# EAGLE design rfm69pi2_rj11_ct (EAGLE 9.6.2)
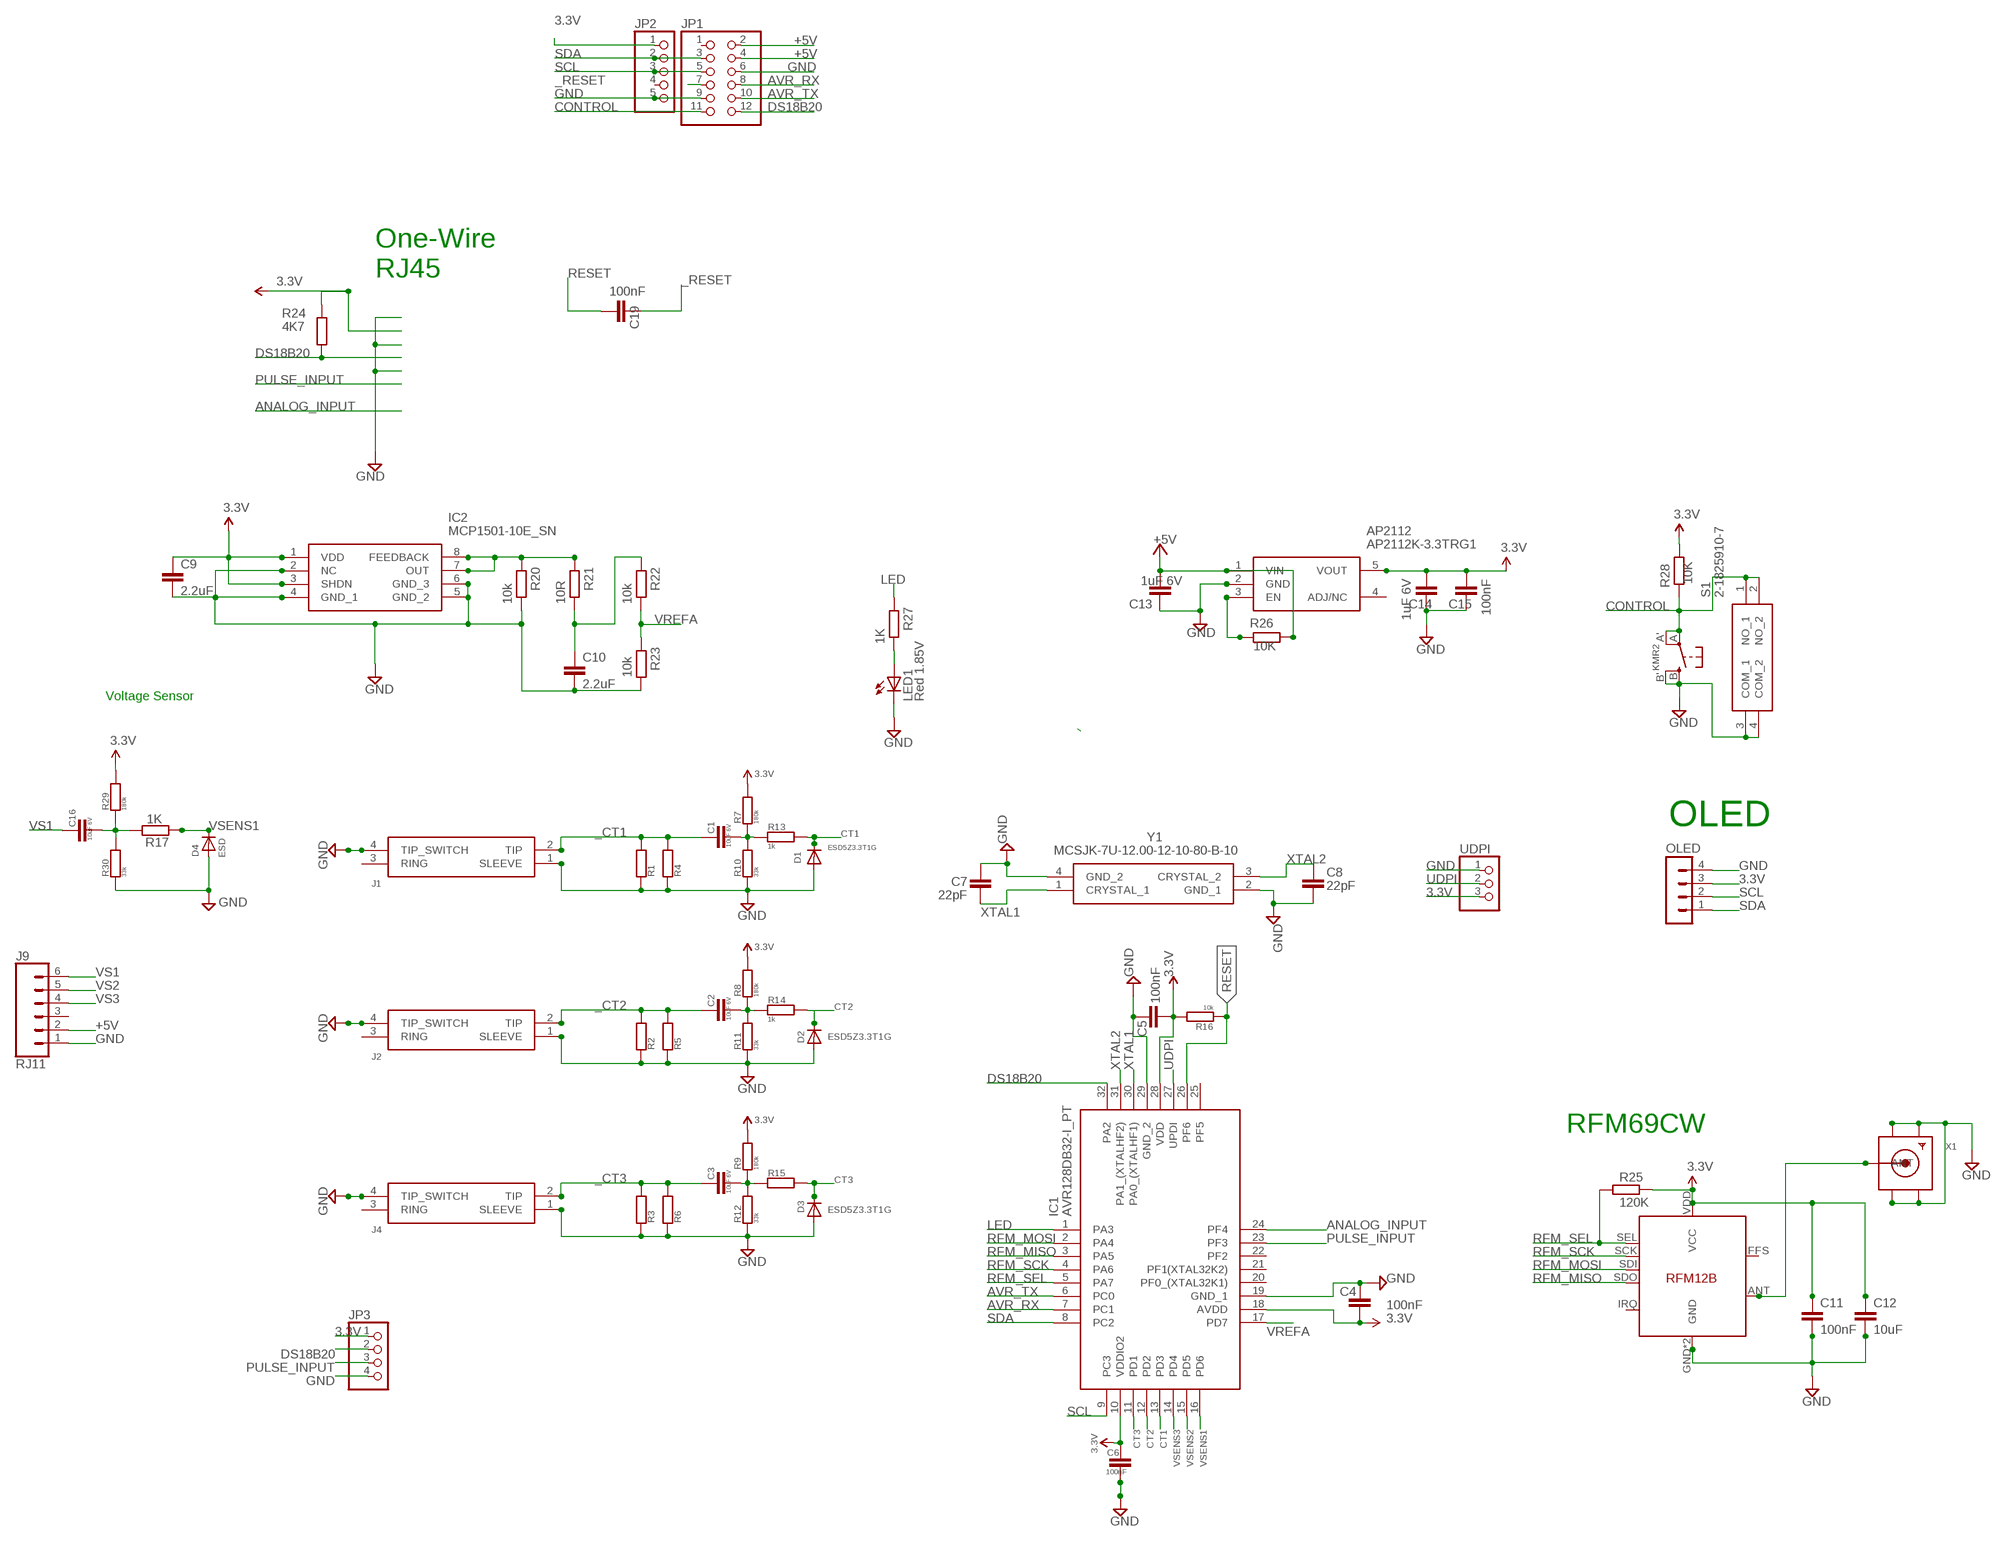
[diagram p0: schematic, sheet 1]

## Parts
AP2112  AP2112K-3.3TRG1  [SOT95P282X130-5N]
C1  10uF 6V  C-EUC0603  [C0603]
C2  10uF 6V  C-EUC0603  [C0603]
C3  10uF 6V  C-EUC0603  [C0603]
C4  100nF  C-EUC0603  [C0603]
C5  100nF  C-EUC0603  [C0603]
C6  100nF  C-EUC0603  [C0603]
C7  22pF  C-EUC0603  [C0603]
C8  22pF  C-EUC0603  [C0603]
C9  2.2uF  C-EUC0603  [C0603]
C10  2.2uF  C-EUC0603  [C0603]
C11  100nF  C-EUC0603  [C0603]
C12  10uF  C-EUC0603  [C0603]
C13  1uF 6V  C-EUC0603  [C0603]
C14  1uF 6V  C-EUC0603  [C0603]
C15  100nF  C-EUC0603  [C0603]
C16  10uF 6V  C-EUC0603  [C0603]
C19  100nF  C-EUC0603  [C0603]
CTRL  KMR2  SWITCH_TACT_SMT4.6X2.8  [BTN_KMR2_4.6X2.8]
D1  ESD5Z3.3T1G  DIODESOD-523  [SOD-523]
D2  ESD5Z3.3T1G  DIODESOD-523  [SOD-523]
D3  ESD5Z3.3T1G  DIODESOD-523  [SOD-523]
D4  ESD  DIODESOD-523  [SOD-523]
IC1  AVR128DB32-I_PT  [QFP80P900X900X120-32N]
IC2  MCP1501-10E_SN  [SOIC127P600X175-8N]
J1  SJ-3524-SMT-TR  [SJ-3524-SMT-TR]
J2  SJ-3524-SMT-TR  [SJ-3524-SMT-TR]
J4  SJ-3524-SMT-TR  [SJ-3524-SMT-TR]
J9  RJ11  RJ11-6  [RJ11-6]
JP1  PINHD-2X6  [2X06]
JP2  PINHD-1X5  [1X05]
JP3  PINHD-1X4  [1X04]
LED1  Red 1.85V  LEDCHIP-LED0805  [CHIP-LED0805]
OLED  MA04-1-OLEDOLED  [MA04-1-OLED]
R1  R-EU_R1206  [R1206]
R2  R-EU_R1206  [R1206]
R3  R-EU_R1206  [R1206]
R4  R-EU_0204/7  [0204/7]
R5  R-EU_0204/7  [0204/7]
R6  R-EU_0204/7  [0204/7]
R7  180k  R-EU_R0603  [R0603]
R8  180k  R-EU_R0603  [R0603]
R9  180k  R-EU_R0603  [R0603]
R10  33k  R-EU_R0603  [R0603]
R11  33k  R-EU_R0603  [R0603]
R12  33k  R-EU_R0603  [R0603]
R13  1k  R-EU_R0603  [R0603]
R14  1k  R-EU_R0603  [R0603]
R15  1k  R-EU_R0603  [R0603]
R16  10k  R-EU_R0603  [R0603]
R17  1K  R-EU_R0603  [R0603]
R20  10k  R-EU_R0603  [R0603]
R21  10R  R-EU_R0603  [R0603]
R22  10k  R-EU_R0603  [R0603]
R23  10k  R-EU_R0603  [R0603]
R24  4K7  R-EU_R0603  [R0603]
R25  120K  R-EU_R0603  [R0603]
R26  10K  R-EU_R0603  [R0603]
R27  1K  R-EU_R0603  [R0603]
R28  10K  R-EU_R0603  [R0603]
R29  180k  R-EU_R0603  [R0603]
R30  33k  R-EU_R0603  [R0603]
S1  2-1825910-7  [218259107]
U$14  RFM12B  [RFM12B]
UDPI  PINHD-1X3  [1X03]
X1  SMACONNECTOR  [SMA90_DIP]
Y1  MCSJK-7U-12.00-12-10-80-B-10  [MCSJK7U1200121080B10]

## Nets
3.3V: AP2112.5(VOUT) C4.1 C5.2 C6.1 C9.1 C11.1 C12.1 C14.2 C15.2 IC1.10(VDDIO2) IC1.18(AVDD) IC1.28(VDD) IC2.1(VDD) IC2.3(SHDN) JP2.1 JP3.1 OLED.3 R7.2 R8.2 R9.2 R16.2 R24.1 R25.2 R28.1 R29.2 U$14.VDD(VCC) UDPI.3
+5V [power]: AP2112.1(VIN) C13.2 J9.2 JP1.2 JP1.4 R26.1
_CT1: C1.1 J1.2(TIP) R1.2 R4.2
_CT2: C2.1 J2.2(TIP) R2.2 R5.2
_CT3: C3.1 J4.2(TIP) R3.2 R6.2
_RESET: C19.1 JP1.7
ANALOG_INPUT: IC1.24(PF4)
AVR_RX: IC1.7(PC1) JP1.8
AVR_TX: IC1.6(PC0) JP1.10
CONTROL: CTRL.A'(P1) CTRL.A(P) JP1.11 R28.2 S1.1(NO_1) S1.2(NO_2)
CT1: D1.K(C) IC1.13(PD3) R13.2
CT2: D2.K(C) IC1.12(PD2) R14.2
CT3: D3.K(C) IC1.11(PD1) R15.1
DIG1: U$14.ANT X1.ANTENNA(ANT)
DS18B20: IC1.32(PA2) JP1.12 JP3.2 R24.2
GND [gnd]: AP2112.2(GND) C4.2 C5.1 C6.2 C7.1 C8.2 C9.2 C10.2 C11.2 C12.2 C13.1 C14.1 C15.1 CTRL.B'(S1) CTRL.B(S) D1.A D2.A D3.A D4.A IC1.19(GND_1) IC1.29(GND_2) IC2.2(NC) IC2.4(GND_1) IC2.5(GND_2) IC2.6(GND_3) J1.1(SLEEVE) J1.4(TIP_SWITCH) J2.1(SLEEVE) J2.4(TIP_SWITCH) J4.1(SLEEVE) J4.4(TIP_SWITCH) J9.1 JP1.6 JP1.9 JP2.5 JP3.4 LED1.C OLED.4 R1.1 R2.1 R3.1 R4.1 R5.1 R6.1 R10.2 R11.2 R12.2 R20.1 R23.1 R30.2 S1.3(COM_1) S1.4(COM_2) U$14.GND U$14.P$12(GND) UDPI.1 X1.GND1 X1.GND2 X1.GND3 X1.GND4 Y1.2(GND_1) Y1.4(GND_2)
LED: IC1.1(PA3) R27.2
N$2: C16.2 R17.2 R29.1 R30.1
N$14: C10.1 R21.1 R22.2
N$15: AP2112.3(EN) R26.2
N$16: C2.2 R8.1 R11.1 R14.1
N$18: C1.2 R7.1 R10.1 R13.1
N$21: C3.2 R9.1 R12.1 R15.2
N$27: IC2.7(OUT) IC2.8(FEEDBACK) R20.2 R21.2
N$41: LED1.A R27.1
PULSE_INPUT: IC1.23(PF3) JP3.3
RESET: C19.2 IC1.26(PF6) R16.1
RFM_MISO: IC1.3(PA5) U$14.SDO
RFM_MOSI: IC1.2(PA4) U$14.SDI
RFM_SCK: IC1.4(PA6) U$14.SCK
RFM_SEL: IC1.5(PA7) R25.1 U$14.SEL
SCL: IC1.9(PC3) JP1.5 JP2.3 OLED.2
SDA: IC1.8(PC2) JP1.3 JP2.2 OLED.1
UDPI: IC1.27(UPDI) UDPI.2
VREFA: IC1.17(PD7) R22.1 R23.2
VS1: C16.1 J9.6
VS2: J9.5
VS3: J9.4
VSENS1: D4.K(C) IC1.16(PD6) R17.1
VSENS2: IC1.15(PD5)
VSENS3: IC1.14(PD4)
XTAL1: C7.2 IC1.30(PA0_(XTALHF1)) Y1.1(CRYSTAL_1)
XTAL2: C8.1 IC1.31(PA1_(XTALHF2)) Y1.3(CRYSTAL_2)
Unconnected: AP2112.4(ADJ/NC) IC1.20(PF0_(XTAL32K1)) IC1.21(PF1(XTAL32K2)) IC1.22(PF2) IC1.25(PF5) J1.3(RING) J2.3(RING) J4.3(RING) J9.3 JP1.1 JP2.4 U$14.FFS U$14.IRQ

## Notes on the sheet
- One-Wire
  RJ45
- Voltage Sensor
- OLED
- RFM69CW

## Library data of the parts
AP2112 = AP2112K-3.3TRG1:AP2112K-3.3TRG1: 600mA 3.3V LDO Regulator Enable SOT23-5 DiodesZetex AP2112K-3.3TRG1, LDO Voltage Regulator, 3.3 V +/-1.5%, 2.5 6 Vin, 5-Pin SOT-23 Source: Datasheet <http://uk.rs-online.com/web/p/products/8283509>; ARROW_PART_NUMBER: AP2112K-3.3TRG1; ARROW_PRICE-STOCK: https://www.arrow.com/en/products/ap2112k-3.3trg1/diodes-incorporated?region=nac; DESCRIPTION: 600mA 3.3V LDO Regulator Enable SOT23-5 DiodesZetex AP2112K-3.3TRG1, LDO Voltage Regulator, 3.3 V +/-1.5%, 2.5 6 Vin, 5-Pin SOT-23; HEIGHT: 1.3mm; MANUFACTURER_NAME: Diodes Inc.; MANUFACTURER_PART_NUMBER: AP2112K-3.3TRG1; MOUSER_PART_NUMBER: 621-AP2112K-3.3TRG1; MOUSER_PRICE-STOCK: https://www.mouser.co.uk/ProductDetail/Diodes-Incorporated/AP2112K-33TRG1?qs=x6A8l6qLYDDPYHosCdzh%2FA%3D%3D
C1-C3 C6-C8 C13-C16 C19 = resistor:C-EU: CAPACITOR, European symbol
C4 C5 C9-C12 = rcl:C-EU: CAPACITOR, European symbol
CTRL = microbuilder:SWITCH_TACT_SMT: SMT Tact Switches 6x6mm - Digikey: P12940SCT-ND KMR2 (4.6x2.8mm) - Digikey: 401-1426-1-ND EVQ-PQHB55 - Light Touch, 160GF (4.5x4.5mm) - Digikey: P8090SCT-ND KMT0 - KMT021 NGJ LHS (etc.) IP68/Waterproof - Digikey: CKN10289CT-ND
D1-D4 = microbuilder:DIODE: Diode SMA Model Volts Amps Type Vf Vr Digikey # Notes SSA34-E3 40V 3A Schottky 480mV @ 3A 200uA @ 40V SSA34-E3/61TGITR-ND CDBA120-G 20V 1A Schottky 500mV @ 1A 500uA @ 20V 641-1014-6-ND REEL MBRA210 10V 2A Schottky 350mV @ 2A 700uA @ 10V MBRA210LT3 SOD-123 Model Volts Amps Type Vf Vr Order # Notes BAT54T1G 30V 200mA Schottky 800mV @ 200mA 2uA @ 25V BAT54T1GOSTR-ND B0530W 30V 500mA Schottky 430mV @ 500mA 130uA @ 30V B0530W-FDICT-ND REEL MBR120 1A 20V Schottky 340mV @ 1A MBR120VLSFT1GOSCT-ND SOD-323 Model Volts Amps Type Vf Vr Order # Notes PMEG2005EJ 20V 500mA Schottky 355mV @ 500mA 568-4110-1-ND ZLLS410 10V 570mA Schottky 380mV @ 570mA ZLLS410CT-ND 1N4148WS 75V 150mA Silicon/Simple 1V 1N4148WSFSCT-ND REEL SOD-523 Model Volts Amps Type Vf Vr Order # Notes BAT54XV2 30V 200mA Schottky 0.8V @ 100mA BAT54XV2CT-ND TB751S 30V 30mA Schottky RB751S-40TE61CT-ND SOT23-R/W (R = Solder Paste/Reflow Ovens, W = Hand-Soldering) Model Volts Amps Type Vf Vr Order # Notes BAT54FILM 40V 300mA Schottky 497-7162-1-ND
IC1 = AVR128DB32-I_PT:AVR128DB32-I_PT: 128KB, TQFP32, 85C, 24MHZ, 12B ADC, COMP, OPAMP, MVIO, ZCD, DAC, UART, SPI, TWI, 32 TQFP 7X7X1MM TRAY ROHS COMPLIANT: YES Source: Datasheet <http://ww1.microchip.com/downloads/en/DeviceDoc/AVR128DB28-32-48-64-DataSheet-DS40002247A.pdf>; ARROW_PART_NUMBER: AVR128DB32-I/PT; ARROW_PRICE-STOCK: https://www.arrow.com/en/products/avr128db32-ipt/microchip-technology?region=nac; DESCRIPTION: 128KB, TQFP32, 85C, 24MHZ, 12B ADC, COMP, OPAMP, MVIO, ZCD, DAC, UART, SPI, TWI, 32 TQFP 7X7X1MM TRAY ROHS COMPLIANT: YES; HEIGHT: 1.2mm; MANUFACTURER_NAME: Microchip; MANUFACTURER_PART_NUMBER: AVR128DB32-I/PT; MOUSER_PART_NUMBER: 579-AVR128DB32-I/PT; MOUSER_PRICE-STOCK: https://www.mouser.co.uk/ProductDetail/Microchip-Technology/AVR128DB32-I-PT?qs=vmHwEFxEFR%252BrKeBb9KOKBg%3D%3D
IC2 = MCP1501-10E_SN:MCP1501-10E_SN: MICROCHIP - MCP1501-10E/SN - VOLTAGE REF, SERIES, 1.024V, NSOIC-8 Source: Datasheet <http://www.farnell.com/datasheets/2015662.pdf>; ARROW_PART_NUMBER: MCP1501-10E/SN; ARROW_PRICE-STOCK: https://www.arrow.com/en/products/mcp1501-10esn/microchip-technology; DESCRIPTION: MICROCHIP - MCP1501-10E/SN - VOLTAGE REF, SERIES, 1.024V, NSOIC-8; HEIGHT: 1.75mm; MANUFACTURER_NAME: Microchip; MANUFACTURER_PART_NUMBER: MCP1501-10E/SN; MOUSER_PART_NUMBER: 579-MCP1501-10E/SN; MOUSER_PRICE-STOCK: https://www.mouser.co.uk/ProductDetail/Microchip-Technology/MCP1501-10E-SN?qs=BA62vJVifGrukY%252BvRXgfwQ%3D%3D
J1 J2 J4 = SJ-3524-SMT-TR:SJ-3524-SMT-TR: Phone Connectors Audio Jacks Source: Datasheet <https://datasheet.datasheetarchive.com/originals/distributors/Datasheets-DGA1/151896.pdf>; ARROW_PART_NUMBER: SJ-3524-SMT-TR; ARROW_PRICE-STOCK: https://www.arrow.com/en/products/sj-3524-smt-tr/cui-devices?region=nac; DESCRIPTION: Phone Connectors Audio Jacks; HEIGHT: mm; MANUFACTURER_NAME: CUI Inc.; MANUFACTURER_PART_NUMBER: SJ-3524-SMT-TR; MOUSER_PART_NUMBER: 490-SJ-3524-SMT-TR; MOUSER_PRICE-STOCK: https://www.mouser.co.uk/ProductDetail/CUI-Devices/SJ-3524-SMT-TR?qs=WyjlAZoYn50%252B7OcNbxvx%252BA%3D%3D
J9 = SparkFun-Connectors:RJ11-6: RJ11 Jack - 6 pin Commonly found on CAT3 devices and some Microchip programmers. Here is the connector we sell at SparkFun: RJ11 6-Pin Connector <https://www.sparkfun.com/products/132> (PRT-00132) Datasheet <http://www.sparkfun.com/datasheets/Prototyping/Connectors/RJ11-Datasheet.pdf> It is used on this SparkFun product: SparkFun Weather Shield <https://www.sparkfun.com/products/12081> (DEV-12081) Weather Meters <https://www.sparkfun.com/products/8942> (SEN-08942); PROD_ID: CONN-08590; SF_ID: PRT-00132
JP1 = pinhead:PINHD-2X6: PIN HEADER
JP2 = pinhead:PINHD-1X5: PIN HEADER
JP3 = pinhead:PINHD-1X4: PIN HEADER
LED1 = adafruit:LED: LED OSRAM: - CHIPLED LG R971, LG N971, LY N971, LG Q971, LY Q971, LO R971, LY R971 LH N974, LH R974 LS Q976, LO Q976, LY Q976 LO Q996 - Hyper CHIPLED LW Q18S LB Q993, LB Q99A, LB R99A - SideLED LS A670, LO A670, LY A670, LG A670, LP A670 LB A673, LV A673, LT A673, LW A673 LH A674 LY A675 LS A676, LA A676, LO A676, LY A676, LW A676 LS A679, LY A679, LG A679 - Hyper Micro SIDELED® LS Y876, LA Y876, LO Y876, LY Y876 LT Y87S - SmartLED LW L88C, LW L88S LB L89C, LB L89S, LG L890 LS L89K, LO L89K, LY L89K LS L896, LA L896, LO L896, LY L896 - TOPLED LS T670, LO T670, LY T670, LG T670, LP T670 LSG T670, LSP T670, LSY T670, LOP T670, LYG T670 LG T671, LOG T671, LSG T671 LB T673, LV T673, LT T673, LW T673 LH T674 LS T676, LA T676, LO T676, LY T676, LB T676, LH T676, LSB T676, LW T676 LB T67C, LV T67C, LT T67C, LS T67K, LO T67K, LY T67K, LW E67C LS E67B, LA E67B, LO E67B, LY E67B, LB E67C, LV E67C, LT E67C LW T67C LS T679, LY T679, LG T679 LS T770, LO T770, LY T770, LG T770, LP T770 LB T773, LV T773, LT T773, LW T773 LH T774 LS E675, LA E675, LY E675, LS T675 LS T776, LA T776, LO T776, LY T776, LB T776 LHGB T686 LT T68C, LB T68C - Hyper Mini TOPLED® LB M676 - Mini TOPLED Santana® LG M470 LS M47K, LO M47K, LY M47K Source: http://www.osram.convergy.de/
OLED = con-lstb-db:MA04-1-OLED: PIN HEADER with OLED footprint.
R1-R17 R20-R30 = rcl:R-EU_: RESISTOR, European symbol
S1 = 2-1825910-7:2-1825910-7: Relays, Contactors & Switches Switches Tactile Switches FSM14JH=6MM TACT SWITCH, HIGH TEMP Source: Datasheet <http://www.te.com/commerce/DocumentDelivery/DDEController?Action=showdoc&DocId=Customer Drawing1825910C10pdfEnglishENG_CD_1825910_C10.pdf2-1825910-7>; ARROW_PART_NUMBER: 2-1825910-7; ARROW_PRICE-STOCK: https://www.arrow.com/en/products/2-1825910-7/te-connectivity?region=europe; DESCRIPTION: Relays, Contactors & Switches Switches Tactile Switches FSM14JH=6MM TACT SWITCH, HIGH TEMP; HEIGHT: 13mm; MANUFACTURER_NAME: TE Connectivity; MANUFACTURER_PART_NUMBER: 2-1825910-7; MOUSER_PART_NUMBER: 506-2-1825910-7; MOUSER_PRICE-STOCK: https://www.mouser.co.uk/ProductDetail/TE-Connectivity-PB/2-1825910-7?qs=epcAG6di8szpGFLvuwXKeQ%3D%3D
U$14 = JeeParts:RFM12B
UDPI = adafruit:PINHD-1X3: PIN HEADER
X1 = adafruit:SMACONNECTOR: SMA Connector 90° DIP SMA Connector, 50 Ohm (4UConnector: 07259)
Y1 = MCSJK-7U-12.00-12-10-80-B-10:MCSJK-7U-12.00-12-10-80-B-10: CRYSTAL, 12MHZ, 12PF, 3.2MM X 2.5MM Source: Datasheet <https://componentsearchengine.com/Datasheets/2/MCSJK-7U-12.00-12-10-80-B-10.pdf>; DESCRIPTION: CRYSTAL, 12MHZ, 12PF, 3.2MM X 2.5MM; HEIGHT: 0.8mm; MANUFACTURER_NAME: MULTICOMP; MANUFACTURER_PART_NUMBER: MCSJK-7U-12.00-12-10-80-B-10

## Net classes
0 default: width 0.203 mm, drill 0.6 mm, clearance 0.203 mm
1 power: width 0.305 mm, drill 0.6 mm, clearance 0.254 mm
2 gnd: width 0.254 mm, drill 0.6 mm, clearance 0.254 mm
3 5V0_PI: width 0.406 mm, drill 0.4 mm
4 3V3_PI: width 0.254 mm, drill 0.4 mm

## Board
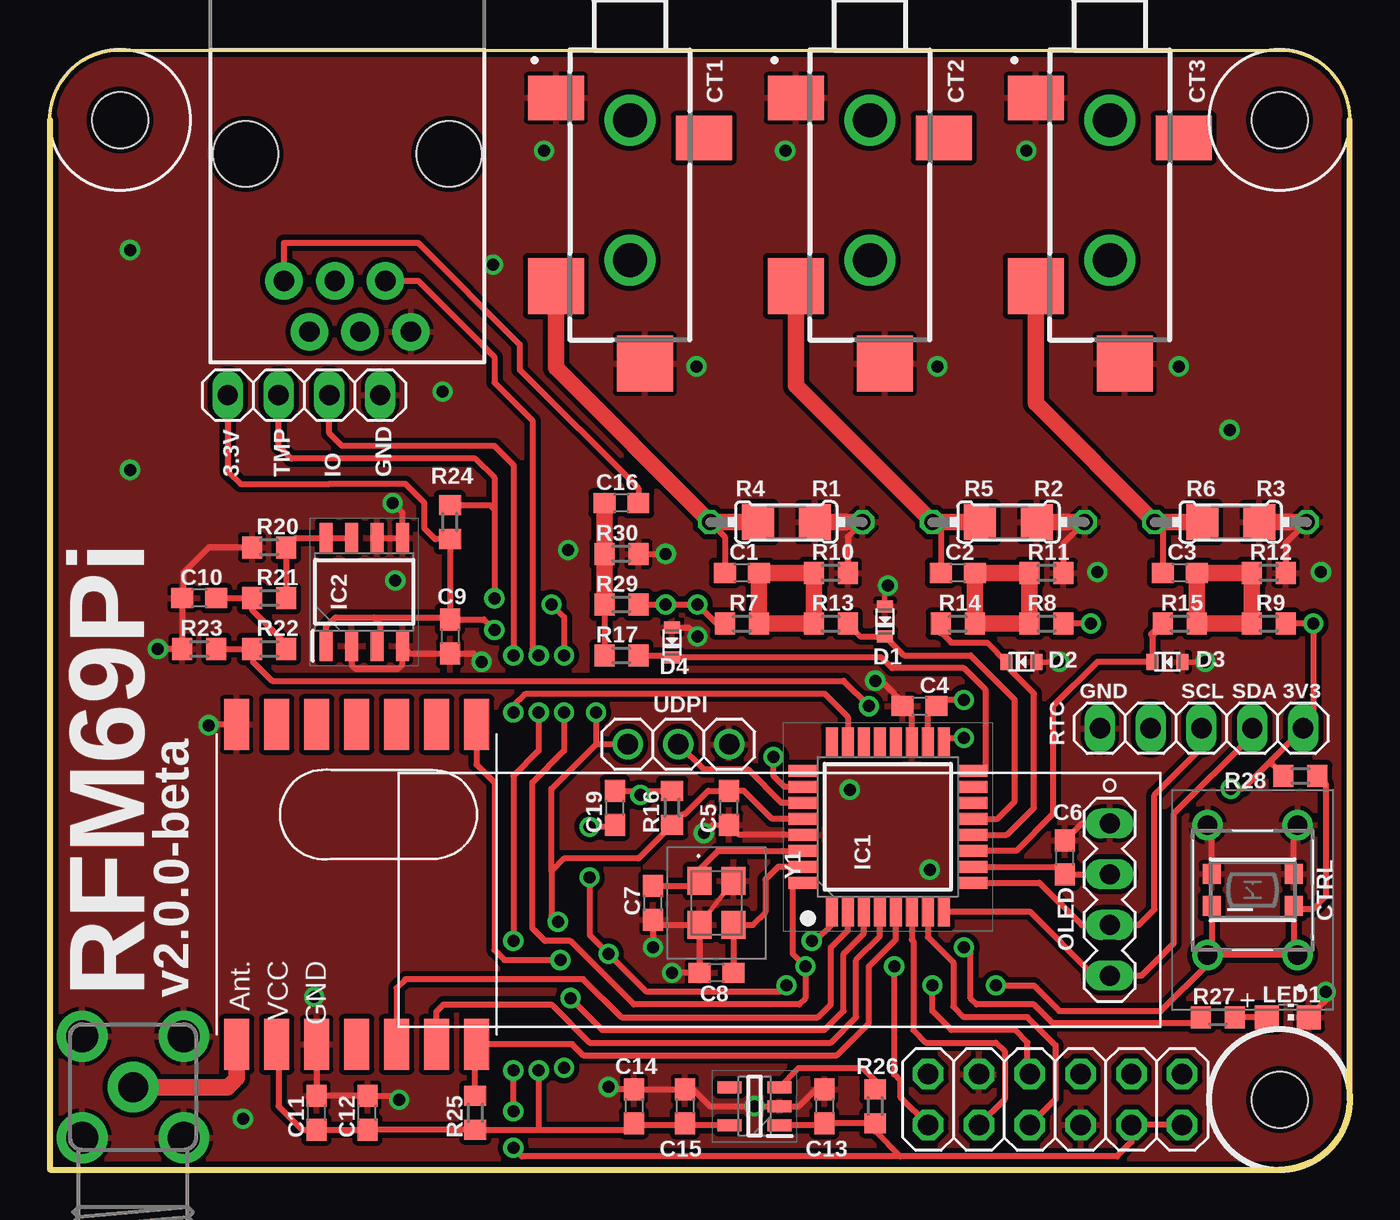
[diagram p1: board, top side]
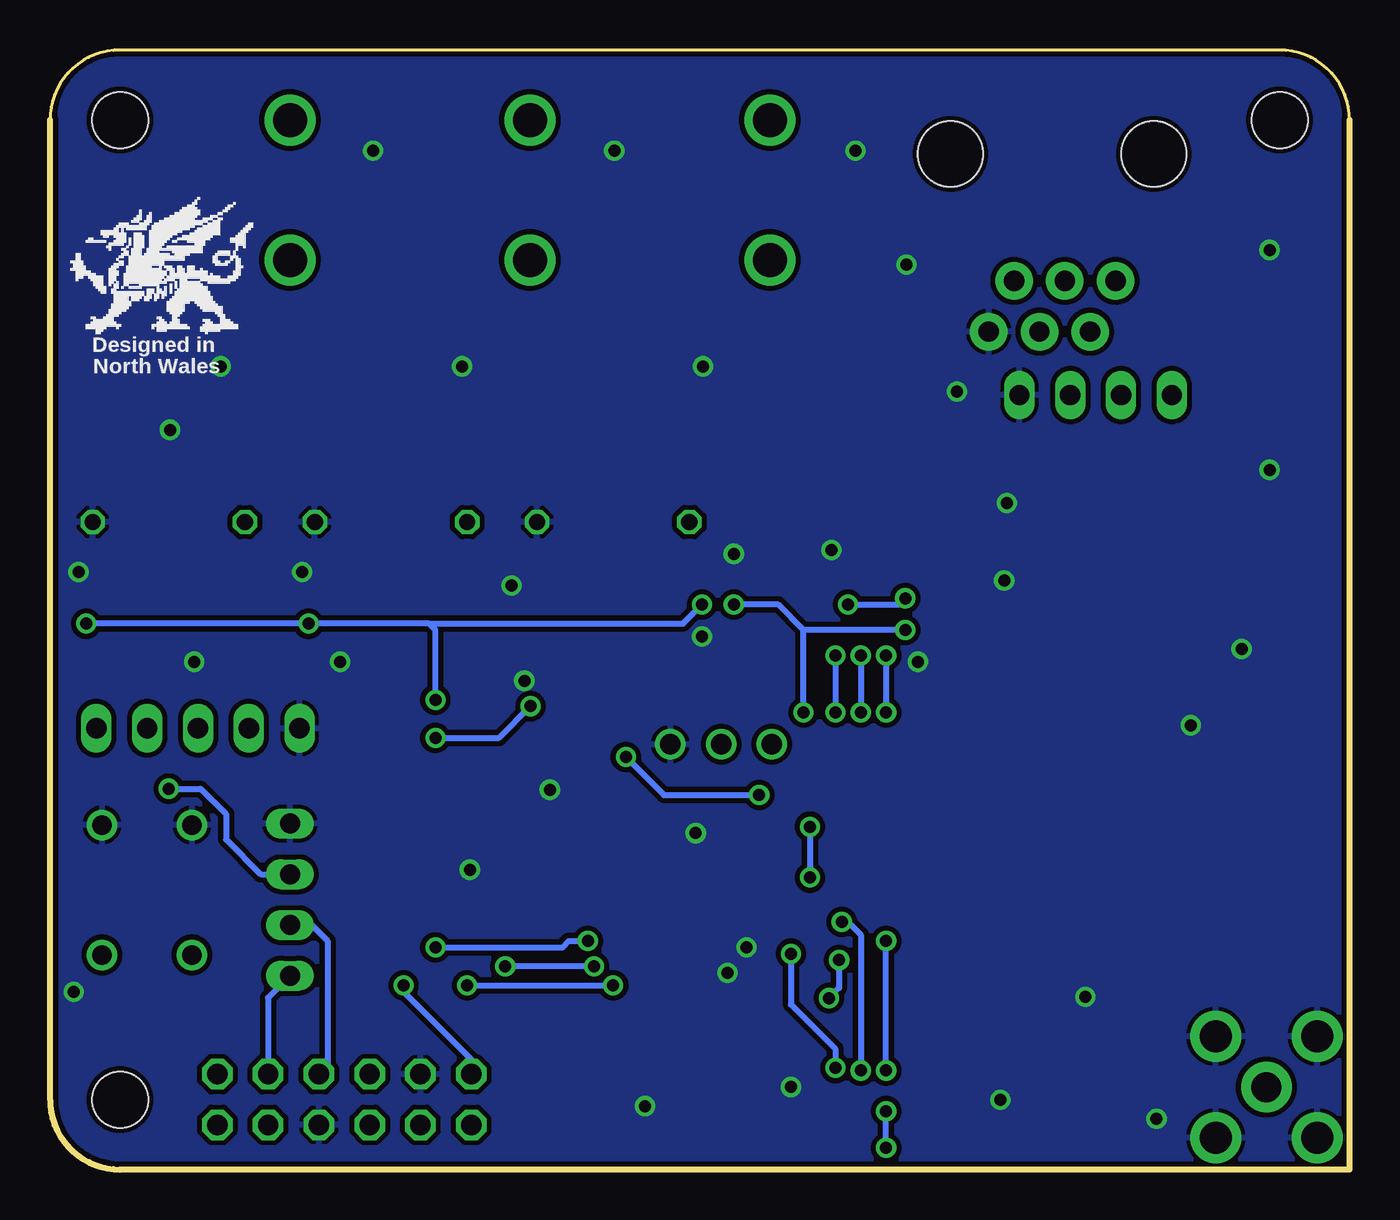
[diagram p2: board, bottom side, seen from below]

Size 65 x 56 mm. Coordinates in mm from the lower left corner, seen from the top.
Outline: 0,0 0,52.5 arc-90 3.5,56 61.5,56 arc-90 65,52.5 65,3.5 arc-90 61.5,0 0,0
Copper layers (1*16): Top 8mil / dielectric 8mil / Bottom 8mil
Design rules "default *": minimum track width 8mil, minimum drill 0.5mm, track to track 8mil, track to pad 8mil, pad to pad 8mil, via to via 8mil, smd to smd 8mil, copper to edge 10mil, drill to drill 8mil, minimum pad ring 8mil, minimum via ring 8mil, stop-mask expansion 0.075mm, vias tented up to drill 0.6mm, thermal gap 8mil
Holes 2.8 mm at 61.5,3.5 3.5,52.5 61.5,52.5

### Footprints (pad centres in the part's own frame; a part is rotated, then mirrored left to right if it is on the bottom)
SOT95P282X130-5N = smd 1.2 x 0.6: 1 -1.25,0.95; 2 -1.25,0; 3 -1.25,-0.95; 4 1.25,-0.95; 5 1.25,0.95
C0603 = smd 1.1 x 1: 1 -0.85,0; 2 0.85,0
BTN_KMR2_4.6X2.8 = smd 0.9 x 1: A 2.05,0.8; A' -2.05,0.8; B 2.05,-0.8; B' -2.05,-0.8
SOD-523 = smd 0.8 x 0.6: A 0,-0.75; K 0,0.75
QFP80P900X900X120-32N = smd 1.475 x 0.6: 1 -4.238,2.8; 2 -4.238,2; 3 -4.238,1.2; 4 -4.238,0.4; 5 -4.238,-0.4; 6 -4.238,-1.2; 7 -4.238,-2; 8 -4.238,-2.8; 17 4.238,-2.8; 18 4.238,-2; 19 4.238,-1.2; 20 4.238,-0.4; 21 4.238,0.4; 22 4.238,1.2; 23 4.238,2; 24 4.238,2.8 | smd 0.6 x 1.475: 9 -2.8,-4.238; 10 -2,-4.238; 11 -1.2,-4.238; 12 -0.4,-4.238; 13 0.4,-4.238; 14 1.2,-4.238; 15 2,-4.238; 16 2.8,-4.238; 25 2.8,4.238; 26 2,4.238; 27 1.2,4.238; 28 0.4,4.238; 29 -0.4,4.238; 30 -1.2,4.238; 31 -2,4.238; 32 -2.8,4.238
SOIC127P600X175-8N = smd 1.5 x 0.65: 1 -2.7,1.905; 2 -2.7,0.635; 3 -2.7,-0.635; 4 -2.7,-1.905; 5 2.7,-1.905; 6 2.7,-0.635; 7 2.7,0.635; 8 2.7,1.905
SJ-3524-SMT-TR = smd 2.2 x 2.8: 1 2.4,-6.7; 3 4.4,0.7 | smd 2.8 x 2.8: 2 11.8,-6.7; 4 15.7,-2.25 | drill 1.7 pad 2.55: 5 3.5,-3; 6 10.5,-3
RJ11-6 = drill 1.016 pad 1.88: 1 -3.175,8.89; 2 -1.905,6.35; 3 -0.635,8.89; 4 0.635,6.35; 5 1.905,8.89; 6 3.175,6.35 | hole 3.251: -5.08,0; 5.08,0
2X06 = drill 1.016 octagon: 1 -6.35,-1.27; 2 -6.35,1.27; 3 -3.81,-1.27; 4 -3.81,1.27; 5 -1.27,-1.27; 6 -1.27,1.27; 7 1.27,-1.27; 8 1.27,1.27; 9 3.81,-1.27; 10 3.81,1.27; 11 6.35,-1.27; 12 6.35,1.27
1X05 = drill 1.016 long: 1 -5.08,0; 2 -2.54,0; 3 0,0; 4 2.54,0; 5 5.08,0
1X04 = drill 1.016 long: 1 -3.81,0; 2 -1.27,0; 3 1.27,0; 4 3.81,0
CHIP-LED0805 = smd 1.2 x 1.2: A 0,-1.05; C 0,1.05
MA04-1-OLED = drill 1 long: 1 -3.81,0; 2 -1.27,0; 3 1.27,0; 4 3.81,0
R1206 = smd 1.6 x 1.803: 1 -1.422,0; 2 1.422,0
0204/7 = drill 0.813 octagon: 1 -3.81,0; 2 3.81,0
R0603 = smd 1 x 1.1: 1 -0.85,0; 2 0.85,0
218259107 = drill 0.99 pad 1.54: 1 2.76,2.25; 2 2.76,-2.25; 3 -3.74,2.25; 4 -3.74,-2.25
RFM12B = smd 2.54 x 1.27: ANT 8,-6; FFS -8,2; GND 8,-2; IRQ -8,4; P$8 -8,0; P$9 -8,-2; P$10 -8,-4; P$12 -8,-6; P$16 8,0; SCK 8,4; SDI 8,2; SDO -8,6; SEL 8,6; VDD 8,-4
1X03 = drill 1.016: 1 -2.54,0; 2 0,0; 3 2.54,0
SMA90_DIP = drill 1.5 pad 2.54: ANTENNA 0,0 | drill 1.6 pad 2.54: GND1 -2.54,2.54; GND2 2.54,2.54; GND3 -2.54,-2.54; GND4 2.54,-2.54
MCSJK7U1200121080B10 = smd 1.4 x 1.2: 1 -1.1,-0.85; 2 1.1,-0.85; 3 1.1,0.85; 4 -1.1,0.85

### Placement (x,y rotation side)
AP2112  35.24,3.17 180 top
C1  34.61,29.84 0 top
C2  45.4,29.84 0 top
C3  56.52,29.84 0 top
C4  43.5,23.18 180 top
C5  33.97,18.1 90 top
C6  50.77,15.61 90 top
C7  30.16,13.34 90 top
C8  33.34,9.84 180 top
C9  20,26.67 270 top
C10  7.47,28.58 180 top
C11  13.34,2.84 90 top
C12  15.88,2.84 90 top
C13  38.73,3.17 270 top
C14  29.21,3.17 270 top
C15  31.75,3.17 270 top
C16  28.57,33.34 180 top
C19  28.26,18.1 90 top
CTRL  60.15,13.99 180 top
D1  41.76,27.42 180 top
D2  48.58,25.4 90 top
D3  55.88,25.4 90 top
D4  31.11,26.35 180 top
IC1  41.91,17.14 90 top
IC2  15.72,28.9 90 top
J1  32,56 270 top
J2  44,56 270 top
J4  56,56 270 top
J9  14.88,50.8 180 top
JP1  50.28,3.5 180 top
JP2  57.6,22.07 180 top
JP3  12.7,38.73 0 top
LED1  61.91,7.62 270 top
OLED  53,13.5 90 top
R1  36.83,32.38 180 top
R2  47.94,32.38 180 top
R3  59.05,32.38 180 top
R4  36.83,32.38 180 top
R5  47.94,32.38 180 top
R6  59.05,32.38 180 top
R7  34.61,27.3 180 top
R8  49.85,27.3 0 top
R9  60.96,27.3 0 top
R10  39.05,29.84 0 top
R11  49.85,29.84 0 top
R12  60.96,29.84 0 top
R13  39.05,27.3 0 top
R14  45.4,27.3 180 top
R15  56.52,27.3 0 top
R16  31.11,18.1 270 top
R17  28.57,25.72 180 top
R20  10.96,31.12 0 top
R21  10.96,28.58 0 top
R22  10.96,26.04 0 top
R23  7.47,26.04 0 top
R24  20,32.38 90 top
R25  21.27,2.84 270 top
R26  41.27,3.17 90 top
R27  58.42,7.62 180 top
R28  62.55,19.68 0 top
R29  28.57,28.26 0 top
R30  28.57,30.8 0 top
S1  60.15,13.49 270 top
U$14  15.34,14.27 270 top
UDPI  31.43,21.27 180 top
X1  4.16,4.12 180 top
Y1  33.34,13.34 270 top

### Tracks (layer width: path | path; a pad name or v marks a point on that pad's centre or on a via)
3.3V  (via drill 0.6)
  Top 0.305: IC1.28 36.11,17.55 34.71,18.95 C5.2 | 33.55,18.95 C5.2 | AP2112.5 31.85,2.22 C15.2 31.65,2.22 29.31,2.22 | 29.31,2.22 C14.2 | IC1.18 43.91,22.74 C4.1 44.66,23.5 v45.72,23.5 | IC1.10 50.38,15.14 C6.1 52.98,14.76 OLED.3 | U$14.VDD 11.43,6.17 11.43,3.17 12.62,1.99 C11.1 C12.1 R25.2 24.45,1.99 | IC2.1 13.82,27.15 14.29,27.62 16.19,27.62 | 16.19,27.62 16.51,27.3 16.51,26.35 IC2.3 | 29.31,2.22 29.08,1.99 24.45,1.99 | v24.45,4.95 24.45,1.99 | C5.2 32.92,18.95 31.75,17.78 31.65,17.78 R16.2 29.43,15.56 25.72,15.56 25.08,14.92 | 25.08,14.92 25.08,19.05 27.3,21.27 | R29.2 v30.8,28.26 v32.38,28.26 33.34,27.3 R7.2 | 16.19,27.62 19.9,27.62 | 19.9,27.62 C9.1 21.69,27.52 v22.23,26.99 | R9.2 v63.18,27.3 63.18,22.58 JP2.1 61.1,20.5 | v52.07,27.3 R8.2 | 61.1,20.5 59.65,19.05 v59.05,19.05 | v27.3,22.86 27.3,21.27 | UDPI.3 27.3,21.27 | 25.08,14.92 25.08,12.7 v25.4,12.38 | 19.9,27.62 20,27.73 R24.1 19.27,31.54 18.73,32.07 18.73,33.34 17.78,34.29 13.97,34.29 9.53,34.29 8.89,34.92 JP3.1 | R28.1 61.1,20.28 61.1,20.5
  Bottom 0.305: v25.4,12.38 25.08,12.38 24.45,11.75 v24.45,4.95 | v27.3,22.86 27.3,26.99 | v30.8,28.26 28.57,28.26 27.3,26.99 | v22.23,26.99 27.3,26.99 | v32.38,28.26 33.34,27.3 46.04,27.3 | 46.04,27.3 v52.07,27.3 v63.18,27.3 | v59.05,19.05 57.47,19.05 56.2,17.78 56.2,16.51 54.46,14.77 OLED.3 | v45.72,23.5 45.72,26.99 46.04,27.3
+5V  (via drill 0.6)
  Top 0.305: JP1.2 JP1.4 54.09,1.39 53.37,0.66 42.52,0.66 | 42.52,0.66 41.27,1.91 R26.1 C13.2 38.63,2.23 AP2112.1 | 42.52,0.66 23.6,0.66 v23.18,1.08 | v24.45,25.72 24.13,26.04 24.13,37.47 22.23,39.37 22.23,40.64 18.41,44.45 J9.2 | v23.18,2.92 v23.18,4.95 | v24.45,22.86 24.45,20.95 23.18,19.68 v23.18,11.43
  Bottom 0.305: v24.45,25.72 v24.45,22.86 | v23.18,1.08 v23.18,2.92 | v23.18,4.95 v23.18,11.43
_CT1
  Top 0.305: R4.2 33.76,31.65 C1.1
  Top 0.813: R1.2 R4.2 25.3,40.1 J1.2
_CT2
  Top 0.305: R5.2 44.55,31.96 C2.1
  Top 0.813: R2.2 R5.2 37.3,39.22 J2.2
_CT3
  Top 0.305: R6.2 55.66,31.96 C3.1
  Top 0.813: R3.2 R6.2 49.3,38.33 J4.2
_RESET  (via drill 0.6)
  Top 0.305: C19.1 28.16,17.14 v26.99,17.14 | v26.99,14.61 26.99,11.75 v27.94,10.79 29.84,8.89 36.51,8.89 v36.83,9.21 | JP1.7 48.9,4.88 48.9,6.35 48.26,6.99 45.09,6.99 44.13,7.94 v44.13,9.21
  Bottom 0.305: v26.99,17.14 v26.99,14.61 | v27.94,10.79 27.94,8.26 25.72,6.03 v25.72,5.08 | v44.13,9.21 v36.83,9.21
AVR_RX
  Top 0.305: JP1.8 50.29,3.51 50.29,6.22 48.9,7.62 45.72,7.62 45.18,8.16 45.18,10.37 43.91,11.64 IC1.7
AVR_TX
  Top 0.305: JP1.10 47.75,3.51 47.75,5.91 47.31,6.35 43.81,6.35 43.18,6.99 43.18,11.43 43.11,11.5 IC1.6
CONTROL  (via drill 0.6)
  Top 0.305: S1.2 S1.1 62.2,10.93 62.2,13.02 | CTRL.A 58.1,10.93 S1.2 | CTRL.A' 62.2,13.02 | S1.2 57.9,10.28 55.56,7.94 50.48,7.94 49.21,9.21 v47.31,9.21 | R28.2 63.82,19.27 63.82,13.65 63.18,13.02 62.2,13.02
  Bottom 0.305: JP1.11 43.93,5.51 47.31,8.89 v47.31,9.21
CT1
  Top 0.305: IC1.13 47.39,17.55 48.26,18.41 48.26,23.5 46.04,25.72 42.72,25.72 D1.K 40.53,26.67 R13.2
CT2
  Top 0.305: IC1.12 47.86,16.75 49.21,18.1 49.21,23.81 47.83,25.2 D2.K 46.88,26.35 45.09,26.35 44.55,26.89
  Top 0.406: R14.2 44.55,26.89
CT3
  Top 0.305: 55.13,26.77 D3.K 52.39,25.4 50.16,23.18 50.16,17.78 48.33,15.95 IC1.11
  Top 0.406: R15.1 55.13,26.77
DIG1
  Top 0.813: X1.ANTENNA 8.89,4.12 9.34,4.57 U$14.ANT
DS18B20  (via drill 0.6)
  Top 0.305: JP1.12 42.55,3.62 42.55,4.45 42.23,4.76 v42.23,10.16 | IC1.32 37.15,14.35 37.15,10.79 v37.78,10.16 37.78,8.57 37.47,8.26 29.21,8.26 26.04,11.43 24.77,11.43 24.13,12.06 24.13,19.37 25.72,20.95 v25.72,22.86 | v25.08,28.26 25.72,27.62 v25.72,25.72 | 22.23,33.02 22.23,34.61 21.27,35.56 12.06,35.56 11.43,36.2 JP3.2 | 22.23,33.02 v22.23,28.57 | R24.2 22.01,33.23 22.23,33.02
  Bottom 0.305: v37.78,10.16 v42.23,10.16 | v25.72,25.72 v25.72,22.86 | v25.08,28.26 22.54,28.26 v22.23,28.57
GND  (via drill 0.6)
  Top 0.254: Y1.2 Y1.4 | v32.7,16.83 33.12,17.25 C5.1 | D2.A v50.48,25.4 | D1.A 41.76,29.06 v41.91,29.21 | D3.A v57.78,25.4
  Top 0.305: CTRL.B 58.1,17.03 S1.4 | CTRL.B' 62.2,17.03 S1.3 | IC1.29 34.48,16.75 C5.1 | IC1.19 43.11,22.71 C4.2 42.65,23.39 41.59,24.45 v41.27,24.45 | C6.2 51.62,17.31 OLED.4 | IC2.6 IC2.5 17.63,32.85 v17.14,33.34 | R20.1 7.94,31.11 6.67,29.84 6.67,28.63 C10.2 R23.1 v5.4,26.04 | C13.1 38.31,4.03 37.47,3.17 AP2112.2 v35.24,3.17 33.02,3.17 32.17,4.03 C15.1 C14.1 28.04,4.03 v27.94,4.13 | U$14.GND C11.2 C12.2 17.27,3.69 v17.46,3.49 | v31.11,9.84 C8.2 Y1.2 30.41,12.23 C7.1 v30.16,11.11 | R6.1 61.81,31.33 R12.2 | R5.1 50.7,31.33 R11.2 | R4.1 39.9,31.65 R10.2 | v63.82,8.89 63.82,8.47 LED1.C | D4.A 31.95,27.1 v32.38,26.67 | R30.2 v30.8,30.8 | v21.59,25.4 21.17,25.82 C9.2 18.01,25.82 IC2.4 17.63,25.25 17.42,25.04 15.28,25.04 15.09,25.23 IC2.2 | U$14.P$12 7.98,22.27 v7.94,22.23
  Top 0.813: R3.1 R6.1 | R2.1 R5.1 | R1.1 R4.1
  other vias: 59,37 40,19 44,15 4,46 4,35 17.27,29.46 25.91,30.99 13.21,8.64 9.65,2.54 52.4,29.89 63.57,29.89 48.84,50.97 36.77,50.97 24.71,50.97 32.33,40.17 44.4,40.17 56.46,40.17 19.63,38.91 22.17,45.26
  pour Top: -1,57 -1,-1 66,-1 66,57
  pour Bottom: -2,58 -2,-2 67,-2 67,58 65,58
LED  (via drill 0.6)
  Top 0.305: R27.2 57.25,7.3 50.16,7.3 49.21,8.26 46.35,8.26 46.04,8.57 46.04,10.79 v45.72,11.11 | IC1.1 39.11,12.27 38.27,11.43 v38.1,11.43
  Bottom 0.305: v38.1,11.43 39.05,11.43 39.37,11.11 v45.72,11.11
N$2
  Top 0.305: R29.1 R17.2
  Top 0.813: C16.2 R30.1 R29.1
N$14
  Top 0.305: C10.1 R21.1 10.11,27.99 11.81,26.29 R22.2
N$15
  Top 0.305: AP2112.3 37.45,5.08 40.64,5.08 41.27,4.45 R26.2
N$16
  Top 0.813: C2.2 R14.1 R8.1 R11.1 C2.2
N$18
  Top 0.813: R10.1 C1.2 R7.1 R13.1 R10.1
N$21
  Top 0.813: C3.2 R15.2 R9.1 R12.1 C3.2
N$27
  Top 0.305: R21.2 R20.2 12.29,31.6 IC2.8 IC2.7
N$41
  Top 0.305: LED1.A R27.1
PULSE_INPUT  (via drill 0.6)
  Top 0.305: v23.18,25.72 23.18,35.24 22.23,36.2 14.61,36.2 13.97,36.83 JP3.3 | v23.18,22.86 23.22,22.9 23.22,23.24 23.75,23.77 23.77,23.77 23.81,23.81 38.73,23.81 39.91,22.64 IC1.23
  Bottom 0.305: v23.18,25.72 v23.18,22.86
RESET  (via drill 0.6)
  Top 0.305: C19.2 29.53,18.95 | 29.53,18.95 R16.1 | IC1.26 36.73,19.14 36.2,19.68 v36.2,20.64 | v29.53,18.73 29.53,18.95
  Bottom 0.305: v36.2,20.64 34.29,18.73 v29.53,18.73
RFM_MISO  (via drill 0.6)
  Top 0.305: U$14.SDO 21.34,20.26 22.23,19.37 22.23,10.99 22.73,10.48 v25.53,10.48 | v26.04,8.57 27.62,6.99 38.73,6.99 39.69,7.94 39.69,10.79 40.71,11.82 IC1.3
  Bottom 0.305: v25.53,10.48 25.53,9.08 v26.04,8.57
RFM_MOSI
  Top 0.305: U$14.SDI 17.34,9.08 17.78,9.53 26.67,9.53 28.57,7.62 38.42,7.62 39.05,8.26 39.05,11.11 39.91,11.97 IC1.2
RFM_SCK
  Top 0.305: U$14.SCK 19.34,7.91 19.68,8.26 25.08,8.26 26.99,6.35 39.05,6.35 40.32,7.62 40.32,10.48 41.51,11.66 IC1.4
RFM_SEL
  Top 0.305: R25.1 21.27,6.2 U$14.SEL 26.12,6.26 26.67,5.71 39.37,5.71 40.96,7.3 40.96,10.16 42.31,11.51 IC1.5
SCL
  Top 0.305: JP2.3 57.6,21.08 55.24,18.73 55.24,13.02 54.46,12.23 OLED.2 51.6,12.23 49.48,14.35 IC1.9
  Bottom 0.305: OLED.2 51.92,12.23 51.12,11.43 51.12,5.2 JP1.5
SDA
  Top 0.305: JP2.2 60.14,21.72 56.2,17.78 56.2,11.3 54.59,9.69 OLED.1 52.22,9.69 49.01,12.91 IC1.8
  Bottom 0.305: 52.22,9.69 OLED.1 54.09,8.6 JP1.3
UDPI
  Top 0.305: IC1.27 36.58,18.34 34.92,20 32.7,20 UDPI.2
VREFA  (via drill 0.6)
  Top 0.305: R23.2 R22.1 10.16,25.99 10.16,25.4 11.11,24.45 39.69,24.45 v40.96,23.18 | IC1.17 44.92,21.59 v45.72,21.59
  Bottom 0.305: v45.72,21.59 42.55,21.59 v40.96,23.18
VS1
  Top 0.305: J9.6 11.7,46.35 18.41,46.35 23.5,41.27 23.5,40.01 29.43,34.08 C16.1
  Top 0.813: C16.1 29.5,33.41
VSENS1
  Top 0.305: IC1.16 46.78,19.95 46.78,24.02 45.72,25.08 42.11,25.08 41.59,25.6 D4.K 31,25.72 R17.1
XTAL1
  Top 0.305: Y1.1 32.49,14.61 | 32.49,14.61 32.49,15.03 33.41,15.95 IC1.30 | C7.2 32.07,14.19 32.49,14.61
XTAL2
  Top 0.305: IC1.31 36.42,15.14 35.77,14.5 35.77,12.87 35.14,12.23 Y1.3 C8.1

### Text on the board
tPlace: CT1 | CT2 | CT3 | 3.3V | TMP | IO | GND | GND | SCL | SDA | 3V3 | RTC | RFM69Pi | v2.0.0-beta
bPlace: Designed in | North Wales
_tsilk: Designed in | North Wales | Made in UK
_bsilk: 165mm ant | 433Mhz | 165mm ant | 165mm ant | 433Mhz | 433Mhz | 868Mhz | 82mm ant | 82mm ant | 82mm ant | 868Mhz | 868Mhz | 78mm ant | 915Mhz | 78mm ant | 915Mhz | 78mm ant | 915Mhz | 165mm ant | 433Mhz | 82mm ant | 868Mhz | 78mm ant | 915Mhz